# Altium schematic sheet no_name.SchDoc
size A2
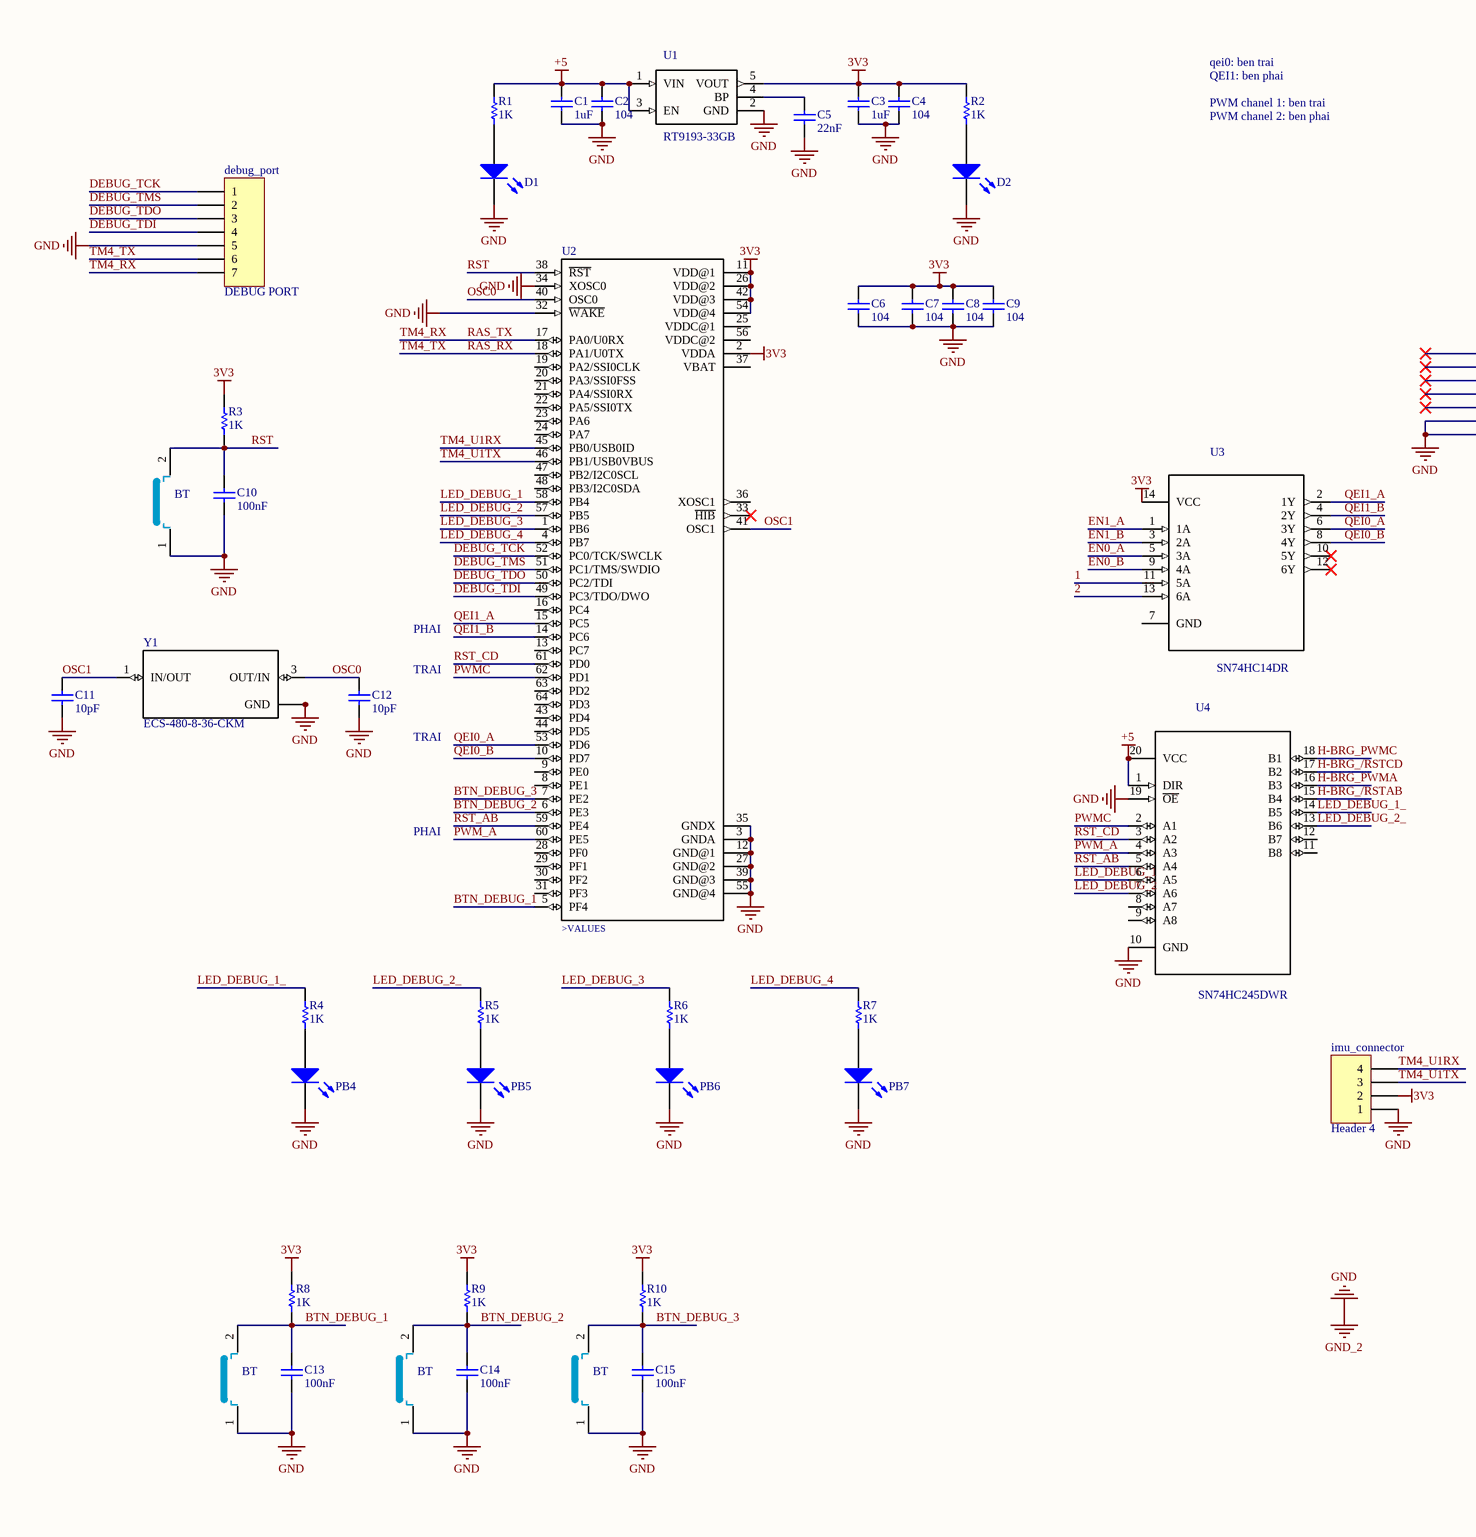
[diagram p0: no_name.SchDoc, left]
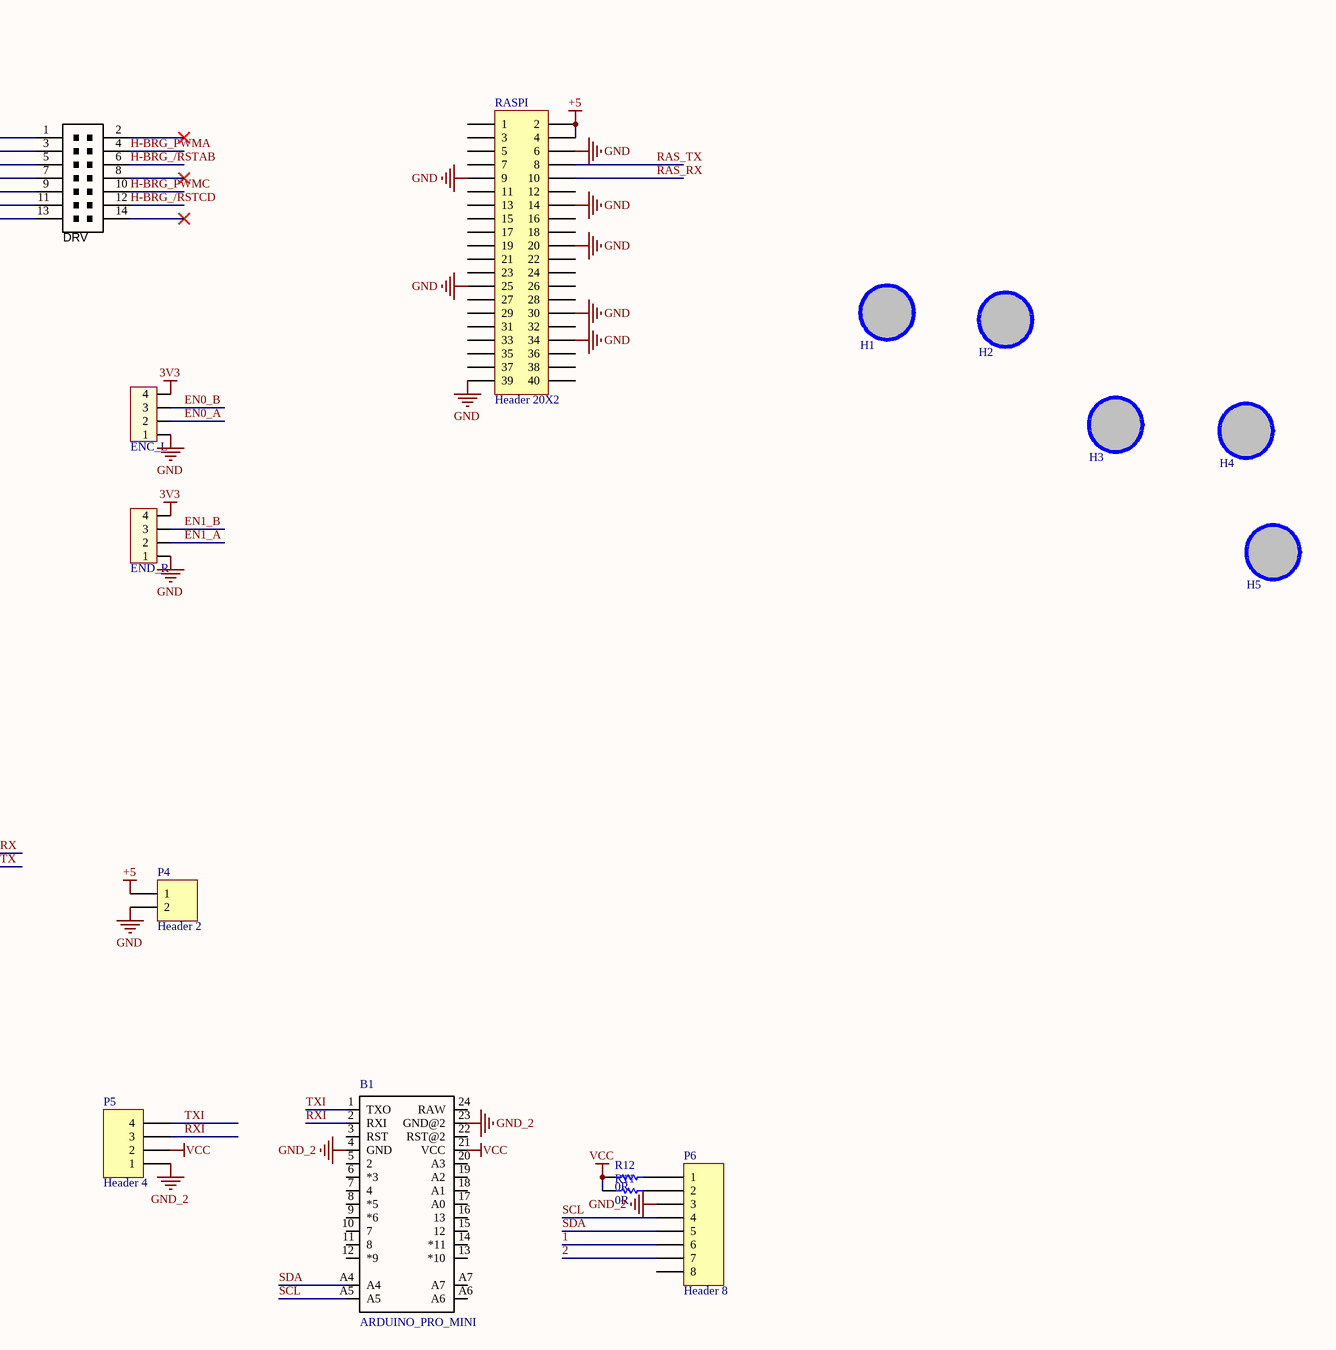
[diagram p1: no_name.SchDoc, right]

## Parts
B1  ARDUINO_PRO_MINI  [*ARDUINO_PRO_MINI_ARDUINO_PRO_MINI(Primary)]
BT1  BT  [SW4]
C1  value 1uF  [CAP-SM-0805]  (hidden comment: Cap Non-Pol SMD)
C2  value 104  [CAP-SM-0805]  (hidden comment: Cap Non-Pol SMD)
C3  value 1uF  [CAP-SM-0805]  (hidden comment: Cap Non-Pol SMD)
C4  value 104  [CAP-SM-0805]  (hidden comment: Cap Non-Pol SMD)
C5  value 22nF  [CAP-SM-0805]  (hidden comment: Cap Non-Pol SMD)
C6  value 104  [CAP-SM-0805]  (hidden comment: Cap Non-Pol SMD)
C7  value 104  [CAP-SM-0805]  (hidden comment: Cap Non-Pol SMD)
C8  value 104  [CAP-SM-0805]  (hidden comment: Cap Non-Pol SMD)
C9  value 104  [CAP-SM-0805]  (hidden comment: Cap Non-Pol SMD)
C10  value 100nF  [CAP-SM-0805]  (hidden comment: Cap Non-Pol SMD)
C11  value 10pF  [CAP-SM-0805]  (hidden comment: Cap Non-Pol SMD)
C12  value 10pF  [CAP-SM-0805]  (hidden comment: Cap Non-Pol SMD)
C13  value 100nF  [CAP-SM-0805]  (hidden comment: Cap Non-Pol SMD)
C14  value 100nF  [CAP-SM-0805]  (hidden comment: Cap Non-Pol SMD)
C15  value 100nF  [CAP-SM-0805]  (hidden comment: Cap Non-Pol SMD)
D1  LED SMD  [LED_0805_Blue]  (value not drawn)
D2  LED SMD  [LED_0805_Blue]  (value not drawn)
debug_port  DEBUG PORT  [HDR1X7]
DRV  shrouded box header  [14P_PCB_HEADER_BRD_MNT_RA]  (value not drawn)
ENC_L  ENC_L  [CON4]
END_R  END_R  [CON4]
H1  Hole  [LO KHOAN 3MM]  (value not drawn)
H2  Hole  [LO KHOAN 3MM]  (value not drawn)
H3  Hole  [LO KHOAN 3MM]  (value not drawn)
H4  Hole  [LO KHOAN 3MM]  (value not drawn)
H5  Hole  [LO KHOAN 3MM]  (value not drawn)
imu_connector  Header 4  [HDR1X4]
P4  Header 2  [HDR1X2]
P5  Header 4  [HDR1X4]
P6  Header 8  [HDR1X8]
PB4  LED SMD  [LED_0805_Blue]  (value not drawn)
PB5  LED SMD  [LED_0805_Blue]  (value not drawn)
PB6  LED SMD  [LED_0805_Blue]  (value not drawn)
PB7  LED SMD  [LED_0805_Blue]  (value not drawn)
PE2  BT  [SW4]
PE3  BT  [SW4]
PF4  BT  [SW4]
R1  value 1K  [RES-SM-0805]  (hidden comment: RESISTOR SMD)
R2  value 1K  [RES-SM-0805]  (hidden comment: RESISTOR SMD)
R3  value 1K  [RES-SM-0805]  (hidden comment: RESISTOR SMD)
R4  value 1K  [RES-SM-0805]  (hidden comment: RESISTOR SMD)
R5  value 1K  [RES-SM-0805]  (hidden comment: RESISTOR SMD)
R6  value 1K  [RES-SM-0805]  (hidden comment: RESISTOR SMD)
R7  value 1K  [RES-SM-0805]  (hidden comment: RESISTOR SMD)
R8  value 1K  [RES-SM-0805]  (hidden comment: RESISTOR SMD)
R9  value 1K  [RES-SM-0805]  (hidden comment: RESISTOR SMD)
R10  value 1K  [RES-SM-0805]  (hidden comment: RESISTOR SMD)
R11  value 0R  [RES-SM-0805]  (hidden comment: RESISTOR SMD)
R12  value 0R  [RES-SM-0805]  (hidden comment: RESISTOR SMD)
RASPI  Header 20X2  [HDR2X20]
U1  RT9193-33GB  [*SOT94P279X129-5N]
U2  TM4C123GH6PMI  [*QFP50P1200X1200X160-64N]  (value not drawn)
U3  SN74HC14DR  [*SOIC127P600X175-14N]
U4  SN74HC245DWR  [*SOIC127P1030X265-20N]
Y1  ECS-480-8-36-CKM  [*XTAL_ECS-480-8-36-CKM]

## Nets
3V3: C3.2 C4.2 C6.2 C7.2 C8.2 C9.2 ENC_L.4 END_R.4 imu_connector.2 R2.2 R3.2 R8.2 R9.2 R10.2 U1.5(VOUT) U2.2(VDDA) U2.11(VDD@1) U2.26(VDD@2) U2.42(VDD@3) U2.54(VDD@4) U3.14(VCC)
+5: C1.2 C2.2 P4.1 R1.2 RASPI.2 RASPI.4 U1.1(VIN) U1.3(EN) U4.1(DIR) U4.20(VCC)
GND: B1.4(GND) B1.23(GND@2) BT1.1 C1.1 C2.1 C3.1 C4.1 C5.1 C6.1 C7.1 C8.1 C9.1 C10.1 C11.1 C12.1 C13.1 C14.1 C15.1 D1.2(K) D2.2(K) debug_port.5 DRV.11 DRV.13 ENC_L.1 END_R.1 imu_connector.1 P4.2 P5.1 P6.3 PB4.2(K) PB5.2(K) PB6.2(K) PB7.2(K) PE2.1 PE3.1 PF4.1 RASPI.6 RASPI.9 RASPI.14 RASPI.20 RASPI.25 RASPI.30 RASPI.34 RASPI.39 U1.2(GND) U2.3(GNDA) U2.12(GND@1) U2.27(GND@2) U2.32(~{WAKE}) U2.34(XOSC0) U2.35(GNDX) U2.39(GND@3) U2.55(GND@4) U4.10(GND) U4.19(~{OE}) Y1.2(GND) Y1.4(GND)  [also labelled GND_2]
VCC: B1.21(VCC) P5.2 R11.1 R12.1
1: P6.6 U3.11(5A)
2: P6.7 U3.13(6A)
BTN_DEBUG_1: C13.2 PF4.2 R8.1 U2.5(PF4)
BTN_DEBUG_2: C14.2 PE3.2 R9.1 U2.6(PE3)
BTN_DEBUG_3: C15.2 PE2.2 R10.1 U2.7(PE2)
DEBUG_TCK: debug_port.1 U2.52(PC0/TCK/SWCLK)
DEBUG_TDI: debug_port.4 U2.49(PC3/TDO/DWO)
DEBUG_TDO: debug_port.3 U2.50(PC2/TDI)
DEBUG_TMS: debug_port.2 U2.51(PC1/TMS/SWDIO)
EN0_A: ENC_L.2 U3.5(3A)
EN0_B: ENC_L.3 U3.9(4A)
EN1_A: END_R.2 U3.1(1A)
EN1_B: END_R.3 U3.3(2A)
H-BRG_/RSTAB: DRV.6 U4.15(B4)
H-BRG_/RSTCD: DRV.12 U4.17(B2)
H-BRG_PWMA: DRV.4 U4.16(B3)
H-BRG_PWMC: DRV.10 U4.18(B1)
LED_DEBUG_1: U2.58(PB4) U4.6(A5)
LED_DEBUG_1_: R4.2 U4.14(B5)
LED_DEBUG_2: U2.57(PB5) U4.7(A6)
LED_DEBUG_2_: R5.2 U4.13(B6)
LED_DEBUG_3: R6.2 U2.1(PB6)
LED_DEBUG_4: R7.2 U2.4(PB7)
OSC0: C12.2 U2.40(OSC0) Y1.3(OUT/IN)
OSC1: C11.2 U2.41(OSC1) Y1.1(IN/OUT)
PWM_A: U2.60(PE5) U4.4(A3)
PWMC: U2.62(PD1) U4.2(A1)
QEI0_A: U2.53(PD6) U3.6(3Y)
QEI0_B: U2.10(PD7) U3.8(4Y)
QEI1_A: U2.15(PC5) U3.2(1Y)
QEI1_B: U2.14(PC6) U3.4(2Y)
RAS_RX: debug_port.6 RASPI.10 U2.18(PA1/U0TX)  [also labelled TM4_TX]
RAS_TX: debug_port.7 RASPI.8 U2.17(PA0/U0RX)  [also labelled TM4_RX]
RST: BT1.2 C10.2 R3.1 U2.38(~{RST})
RST_AB: U2.59(PE4) U4.5(A4)
RST_CD: U2.61(PD0) U4.3(A2)
RXI: B1.2(RXI) P5.3
SCL: B1.A5 P6.4
SDA: B1.A4 P6.5
TM4_U1RX: imu_connector.4 U2.45(PB0/USB0ID)
TM4_U1TX: imu_connector.3 U2.46(PB1/USB0VBUS)
TXI: B1.1(TXO) P5.4
NetC5_2: C5.2 U1.4(BP)
NetD1_1: D1.1(A) R1.1
NetD2_1: D2.1(A) R2.1
NetP6_1: P6.1 R12.2
NetP6_2: P6.2 R11.2
NetPB4_1: PB4.1(A) R4.1
NetPB5_1: PB5.1(A) R5.1
NetPB6_1: PB6.1(A) R6.1
NetPB7_1: PB7.1(A) R7.1

Not connected (* = marked no-connect by the designer): B1 3(RST) 5(2) 6(*3) 7(4) 8(*5) 9(*6) 10(7) 11(8) 12(*9) 13(*10) 14(*11) 15(12) 16(13) 17(A0) 18(A1) 19(A2) 20(A3) 22(RST@2) 24(RAW) A6 A7; DRV 1* 2* 3* 5* 7* 8* 9* 14*; H1 1; H2 1; H3 1; H4 1; H5 1; P6 8; RASPI 1 3 5 7 11 12 13 15 16 17 18 19 21 22 23 24 26 27 28 29 31 32 33 35 36 37 38 40; U2 8(PE1) 9(PE0) 13(PC7) 16(PC4) 19(PA2/SSI0CLK) 20(PA3/SSI0FSS) 21(PA4/SSI0RX) 22(PA5/SSI0TX) 23(PA6) 24(PA7) 25(VDDC@1) 28(PF0) 29(PF1) 30(PF2) 31(PF3) 33(~{HIB})* 36(XOSC1) 37(VBAT) 43(PD4) 44(PD5) 47(PB2/I2C0SCL) 48(PB3/I2C0SDA) 56(VDDC@2) 63(PD2) 64(PD3); U3 7(GND) 10(5Y)* 12(6Y)*; U4 8(A7) 9(A8) 11(B8) 12(B7)

## Notes on the sheet
- qei0: ben trai
- QEI1: ben phai
- PWM chanel 1: ben trai
- PWM chanel 2: ben phai
- PHAI
- TRAI
- (in symbol TM4C123GH6PMI) >VALUES

## Library data of the parts
B1 = ARDUINO_PRO_MINI: Arduino Pro Mini 328 - 3.3V/8 MHz; SnapEDA_Link: https://www.snapeda.com/parts/ARDUINO%20PRO%20MINI/Arduino/view-part/?ref=snap; MF: Arduino; Price: None; Availability: Unavailable; Package: Package Analog Devices; MP: ARDUINO PRO MINI; Value: *
BT1 PE2 PE3 PF4 = BUTTON
C1-C15 = Cap Non-Pol SMD: Capacitor
D1 D2 PB4-PB7 = LED SMD: LED
debug_port = Header 7: Header, 7-Pin; LatestRevisionDate: 17-Jul-2002; LatestRevisionNote: Re-released for DXP Platform.; Publisher: Altium Limited
DRV = CONN_HEADER_2x7P_RA_0.100in_Male: Header THD 14 POS Double-row right-angle 2.54mm pitch; Manufacturer 1: 3M; Manufacturer Part Number 1: D2514-5002-AR; Pitch: 0.100" (2.54mm); Value: Double-row, 14 positions; QtyOverride: 1; Connector Type: Header, Shrouded; Number of Positions: 14; SCDType: source; Package / Case: Connector header; 2.54mm pitch; Contact Type: Male Pin; Number of Rows: 2; Row Spacing: 0.100" (2.54mm); Contact Mating Length: 0.243" (6.17mm); ComponentLink1URL: http://multimedia.3m.com/mws/mediawebserver?66666UuZjcFSLXTtm8T_oxMcEVuQEcuZgVs6EVs6E666666--; ComponentLink1Description: http://multimedia.3m.com/mws/mediawebserver?66666UuZjcFSLXTtm8T_oxMcEVuQEcuZgVs6EVs6E666666--; Supplier 1: Digi-Key; Supplier Part Number 1: MHE14E-ND
ENC_L END_R = Con4: Connector 4; Value: Connector 4
H1-H5 = Hole: Hole 3mm
imu_connector P5 = Header 4: Header, 4-Pin; LatestRevisionDate: 17-Jul-2002; LatestRevisionNote: Re-released for DXP Platform.; Publisher: Altium Limited
P4 = Header 2: Header, 2-Pin; LatestRevisionDate: 17-Jul-2002; LatestRevisionNote: Re-released for DXP Platform.; Publisher: Altium Limited
P6 = Header 8: Header, 8-Pin; LatestRevisionDate: 17-Jul-2002; LatestRevisionNote: Re-released for DXP Platform.; Publisher: Altium Limited
R1-R12 = RESISTOR SMD: Resistor
RASPI = Header 20X2: Header, 20-Pin, Dual row; LatestRevisionDate: 17-Jul-2002; LatestRevisionNote: Re-released for DXP Platform.; Publisher: Altium Limited
U1 = RT9193-33GB: RT9193 Series 300 mA 3.3 V Ultra-Low Noise Ultra-Fast CMOS LDO Regulator-SC-70-5; MF: Richtek USA; MP: RT9193-33GB; Package: SOT-23-5 Richtek; Availability: Unavailable; Price: None; SnapEDA_Link: https://www.snapeda.com/parts/RT9193-33GB/Richtek%20USA%20Inc./view-part/?ref=snap; Value: *
U2 = TM4C123GH6PMI: MCU 32-Bit Tiva C ARM Cortex M4F RISC 256KB Flash 1.2V/3.3V 64-Pin LQFP Tray/Tube; MF: Texas Instruments; MP: TM4C123GH6PMI; Package: LQFP-64 Texas Instruments; Availability: Unavailable; Price: None; SnapEDA_Link: https://www.snapeda.com/parts/TM4C123GH6PMI/Texas%20Instruments/view-part/?ref=snap; Value: *
U3 = SN74HC14DR: Inverter Schmitt Trigger 6-Element CMOS 14-Pin SOIC T/R; MF: Texas Instruments; Price: None; Availability: Unavailable; MP: SN74HC14DR; Package: SOIC-14 Texas Instruments; SnapEDA_Link: https://www.snapeda.com/parts/SN74HC14DR/Texas%20Instruments/view-part/?ref=snap; Value: *
U4 = SN74HC245DWR: Logic IC - Receiver, transceiver Texas Instruments SN74HC245DWR SOIC 20; Price: None; Availability: Unavailable; MP: SN74HC245DWR; Package: SOIC-20 Texas Instruments; SnapEDA_Link: https://www.snapeda.com/parts/SN74HC245DWR/Texas%20Instruments/view-part/?ref=snap; MF: Texas Instruments; Value: *
Y1 = ECS-480-8-36-CKM: The miniature ECX-2236 is a very compact SMD Crystal. The 2.5 x 2.0 x 0.55 mm ceramic package is ideal for today's SMD manufacturing environment.; MF: ECS Inc.; MP: ECS-480-8-36-CKM; Package: Package Analog Devices; Availability: Unavailable; Price: None; SnapEDA_Link: https://www.snapeda.com/parts/ECS-480-8-36-CKM/ECS%20Inc./view-part/?ref=snap; Value: *